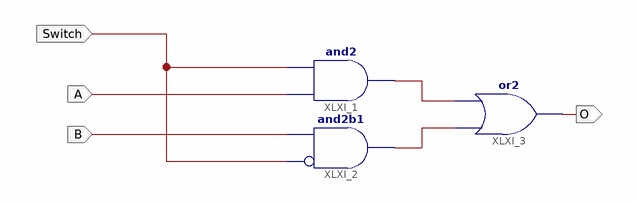
[diagram p0: schematic sheet 1]
// Xilinx ISE schematic Mux2to1.sch (spartan3e) as structural Verilog: 3 symbols, 4 ports
module Mux2to1 (
  input  Switch,
  input  A,
  input  B,
  output O
);

  wire XLXN_1, XLXN_2;

  and XLXI_1 (XLXN_1, A, Switch);
  and XLXI_2 (XLXN_2, ~Switch, B);  // and2b1
  or XLXI_3 (O, XLXN_2, XLXN_1);
endmodule
